# Altium schematic sheet 09_USB_HDMI.SchDoc: USB and HDMI sockets
size A3; Organization: Lime Microsystems; Address1: Surrey Tech Centre; Address2: Guildford GU2 7YG; Address3: Surrey; Address4: United Kingdom; Revision: v1.2; SheetNumber: 9; SheetTotal: 13
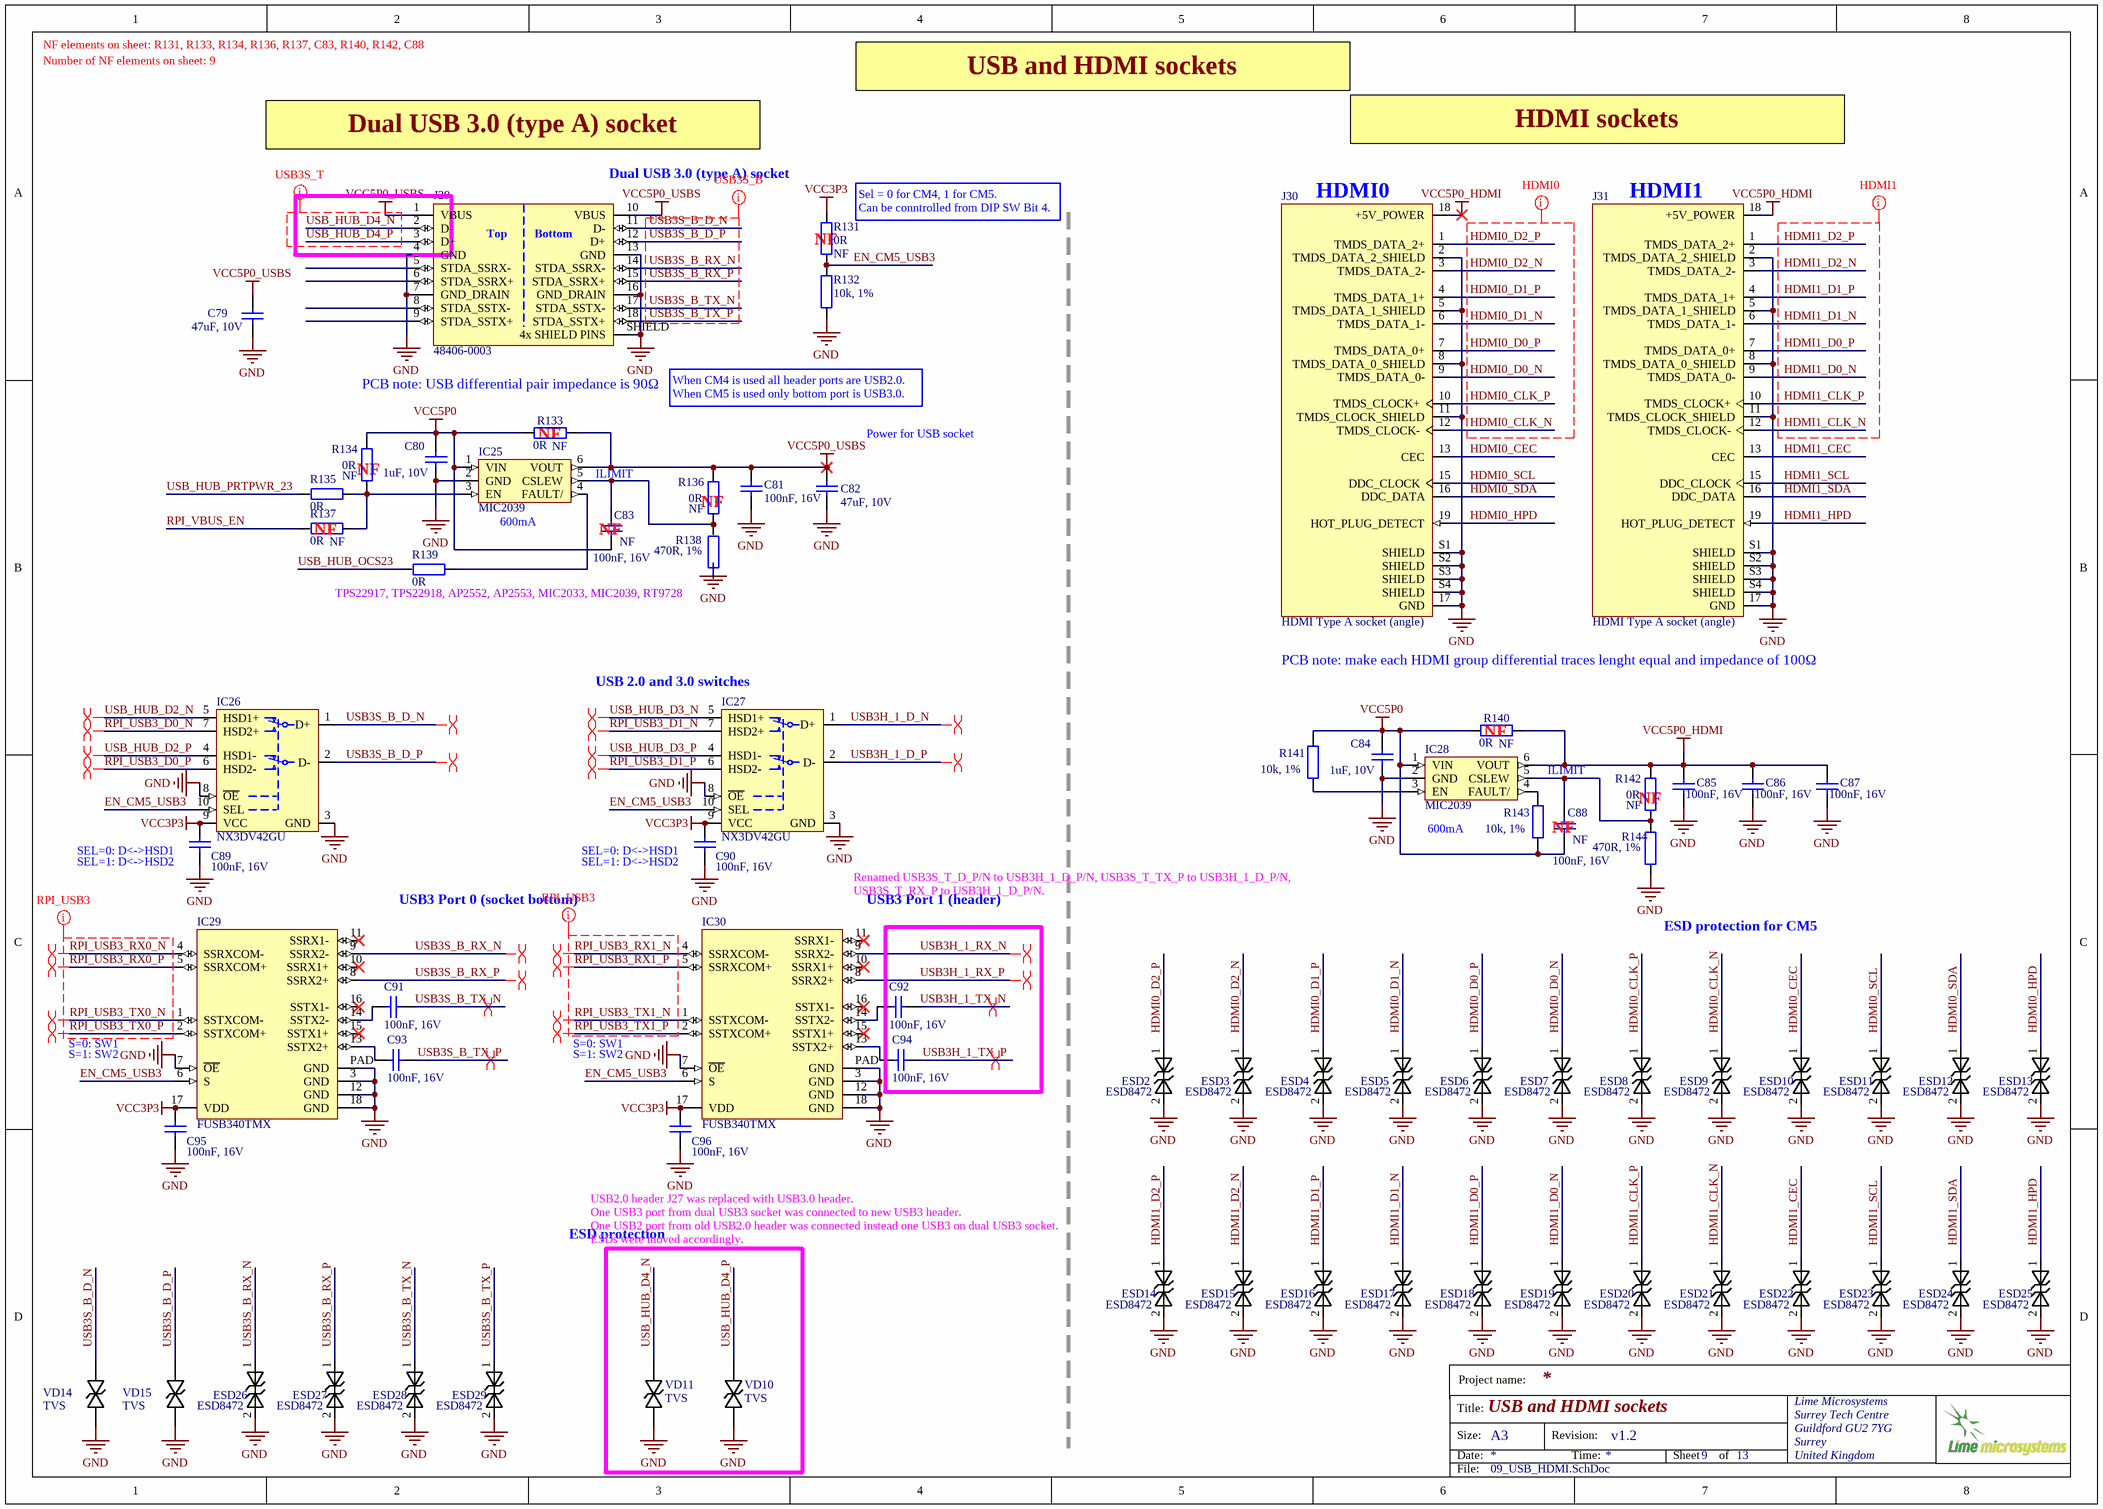
[diagram p0: 09_USB_HDMI.SchDoc]

## Parts
C79  47uF, 10V  [CAP1206]
C80  1uF, 10V  [CAP0402]
C81  100nF, 16V  [CAP0402]
C82  47uF, 10V  [CAP1206]
C83  100nF, 16V  Assembly Info: NF  [CAP0402]
C84  1uF, 10V  [CAP0402]
C85  100nF, 16V  [CAP0402]
C86  100nF, 16V  [CAP0402]
C87  100nF, 16V  [CAP0402]
C88  100nF, 16V  Assembly Info: NF  [CAP0402]
C89  100nF, 16V  [CAP0402]
C90  100nF, 16V  [CAP0402]
C91  100nF, 16V  [CAP0402]
C92  100nF, 16V  [CAP0402]
C93  100nF, 16V  [CAP0402]
C94  100nF, 16V  [CAP0402]
C95  100nF, 16V  [CAP0402]
C96  100nF, 16V  [CAP0402]
ESD2  ESD8472  [ESD8472_X3DFN2]
ESD3  ESD8472  [ESD8472_X3DFN2]
ESD4  ESD8472  [ESD8472_X3DFN2]
ESD5  ESD8472  [ESD8472_X3DFN2]
ESD6  ESD8472  [ESD8472_X3DFN2]
ESD7  ESD8472  [ESD8472_X3DFN2]
ESD8  ESD8472  [ESD8472_X3DFN2]
ESD9  ESD8472  [ESD8472_X3DFN2]
ESD10  ESD8472  [ESD8472_X3DFN2]
ESD11  ESD8472  [ESD8472_X3DFN2]
ESD12  ESD8472  [ESD8472_X3DFN2]
ESD13  ESD8472  [ESD8472_X3DFN2]
ESD14  ESD8472  [ESD8472_X3DFN2]
ESD15  ESD8472  [ESD8472_X3DFN2]
ESD16  ESD8472  [ESD8472_X3DFN2]
ESD17  ESD8472  [ESD8472_X3DFN2]
ESD18  ESD8472  [ESD8472_X3DFN2]
ESD19  ESD8472  [ESD8472_X3DFN2]
ESD20  ESD8472  [ESD8472_X3DFN2]
ESD21  ESD8472  [ESD8472_X3DFN2]
ESD22  ESD8472  [ESD8472_X3DFN2]
ESD23  ESD8472  [ESD8472_X3DFN2]
ESD24  ESD8472  [ESD8472_X3DFN2]
ESD25  ESD8472  [ESD8472_X3DFN2]
ESD26  ESD8472  [ESD8472_X3DFN2]
ESD27  ESD8472  [ESD8472_X3DFN2]
ESD28  ESD8472  [ESD8472_X3DFN2]
ESD29  ESD8472  [ESD8472_X3DFN2]
IC25  MIC2039  [SOT23-6]
IC26  NX3DV42GU  [FSUSB42UMX]
IC27  NX3DV42GU  [FSUSB42UMX]
IC28  MIC2039  [SOT23-6]
IC29  FUSB340TMX  [FUSB340TMX_USB_switch_18-XFQFN]
IC30  FUSB340TMX  [FUSB340TMX_USB_switch_18-XFQFN]
J29  48406-0003  [Dual_USB_48406-0003_Molex]
J30  HDMI Type A socket (angle)  [HDMI_HD01-19-RA-TH]
J31  HDMI Type A socket (angle)  [HDMI_HD01-19-RA-TH]
R131  0R  Assembly Info: NF  [RES0402]
R132  10k, 1%  [RES0402]
R133  0R  Assembly Info: NF  [RES0402]
R134  0R  Assembly Info: NF  [RES0402]
R135  0R  [RES0402]
R136  0R  Assembly Info: NF  [RES0402]
R137  0R  Assembly Info: NF  [RES0402]
R138  470R, 1%  [RES0402]
R139  0R  [RES0402]
R140  0R  Assembly Info: NF  [RES0402]
R141  10k, 1%  [RES0402]
R142  0R  Assembly Info: NF  [RES0402]
R143  10k, 1%  [RES0402]
R144  470R, 1%  [RES0402]
VD10  TVS  [SOD323]
VD11  TVS  [SOD323]
VD14  TVS  [SOD323]
VD15  TVS  [SOD323]

## Nets
GND: C79.1 C80.2 C81.2 C82.1 C84.2 C85.2 C86.2 C87.2 C89.2 C90.2 C95.2 C96.2 ESD2.2 ESD3.2 ESD4.2 ESD5.2 ESD6.2 ESD7.2 ESD8.2 ESD9.2 ESD10.2 ESD11.2 ESD12.2 ESD13.2 ESD14.2 ESD15.2 ESD16.2 ESD17.2 ESD18.2 ESD19.2 ESD20.2 ESD21.2 ESD22.2 ESD23.2 ESD24.2 ESD25.2 ESD26.2 ESD27.2 ESD28.2 ESD29.2 IC25.2(GND) IC26.3(GND) IC26.8(~{OE}) IC27.3(GND) IC27.8(~{OE}) IC28.2(GND) IC29.3(GND) IC29.7(~{OE}) IC29.12(GND) IC29.18(GND) IC29.PAD(GND) IC30.3(GND) IC30.7(~{OE}) IC30.12(GND) IC30.18(GND) IC30.PAD(GND) J29.4(GND) J29.7(GND_DRAIN) J29.13(GND) J29.16(GND_DRAIN) J29.SHIELD(4x_SHIELD_PINS) J30.2(TMDS_DATA_2_SHIELD) J30.5(TMDS_DATA_1_SHIELD) J30.8(TMDS_DATA_0_SHIELD) J30.11(TMDS_CLOCK_SHIELD) J30.17(GND) J30.S1(SHIELD) J30.S2(SHIELD) J30.S3(SHIELD) J30.S4(SHIELD) J31.2(TMDS_DATA_2_SHIELD) J31.5(TMDS_DATA_1_SHIELD) J31.8(TMDS_DATA_0_SHIELD) J31.11(TMDS_CLOCK_SHIELD) J31.17(GND) J31.S1(SHIELD) J31.S2(SHIELD) J31.S3(SHIELD) J31.S4(SHIELD) R132.2 R138.1 R144.1 VD10.K VD11.K VD14.K VD15.K
VCC3P3: C89.1 C90.1 C95.1 C96.1 IC26.9(VCC) IC27.9(VCC) IC29.17(VDD) IC30.17(VDD) R131.2
VCC5P0: C80.1 C83.2 C84.1 C88.2 IC25.1(VIN) IC28.1(VIN) R133.2 R134.2 R140.2 R141.2 R143.1
VCC5P0_HDMI: C85.1 C86.1 C87.1 IC28.6(VOUT) J30.18(+5V_POWER) J31.18(+5V_POWER) R140.1 R142.2
VCC5P0_USBS: C79.2 C81.1 C82.2 IC25.6(VOUT) J29.1(VBUS) J29.10(VBUS) R133.1 R136.2
EN_CM5_USB3: IC26.10(SEL) IC27.10(SEL) IC29.6(S) IC30.6(S) R131.1 R132.1
HDMI0_CEC: ESD10.1 J30.13(CEC)
HDMI0_CLK_N: ESD9.1 J30.12(TMDS_CLOCK-)
HDMI0_CLK_P: ESD8.1 J30.10(TMDS_CLOCK+)
HDMI0_D0_N: ESD7.1 J30.9(TMDS_DATA_0-)
HDMI0_D0_P: ESD6.1 J30.7(TMDS_DATA_0+)
HDMI0_D1_N: ESD5.1 J30.6(TMDS_DATA_1-)
HDMI0_D1_P: ESD4.1 J30.4(TMDS_DATA_1+)
HDMI0_D2_N: ESD3.1 J30.3(TMDS_DATA_2-)
HDMI0_D2_P: ESD2.1 J30.1(TMDS_DATA_2+)
HDMI0_HPD: ESD13.1 J30.19(HOT_PLUG_DETECT)
HDMI0_SCL: ESD11.1 J30.15(DDC_CLOCK)
HDMI0_SDA: ESD12.1 J30.16(DDC_DATA)
HDMI1_CEC: ESD22.1 J31.13(CEC)
HDMI1_CLK_N: ESD21.1 J31.12(TMDS_CLOCK-)
HDMI1_CLK_P: ESD20.1 J31.10(TMDS_CLOCK+)
HDMI1_D0_N: ESD19.1 J31.9(TMDS_DATA_0-)
HDMI1_D0_P: ESD18.1 J31.7(TMDS_DATA_0+)
HDMI1_D1_N: ESD17.1 J31.6(TMDS_DATA_1-)
HDMI1_D1_P: ESD16.1 J31.4(TMDS_DATA_1+)
HDMI1_D2_N: ESD15.1 J31.3(TMDS_DATA_2-)
HDMI1_D2_P: ESD14.1 J31.1(TMDS_DATA_2+)
HDMI1_HPD: ESD25.1 J31.19(HOT_PLUG_DETECT)
HDMI1_SCL: ESD23.1 J31.15(DDC_CLOCK)
HDMI1_SDA: ESD24.1 J31.16(DDC_DATA)
RPI_USB3_D0_N: IC26.7(HSD2+)
RPI_USB3_D0_P: IC26.6(HSD2-)
RPI_USB3_D1_N: IC27.7(HSD2+)
RPI_USB3_D1_P: IC27.6(HSD2-)
RPI_USB3_RX0_N: IC29.4(SSRXCOM-)
RPI_USB3_RX0_P: IC29.5(SSRXCOM+)
RPI_USB3_RX1_N: IC30.4(SSRXCOM-)
RPI_USB3_RX1_P: IC30.5(SSRXCOM+)
RPI_USB3_TX0_N: IC29.1(SSTXCOM-)
RPI_USB3_TX0_P: IC29.2(SSTXCOM+)
RPI_USB3_TX1_N: IC30.1(SSTXCOM-)
RPI_USB3_TX1_P: IC30.2(SSTXCOM+)
RPI_VBUS_EN: R137.2
USB3H_1_D_N: IC27.1(D+)
USB3H_1_D_P: IC27.2(D-)
USB3H_1_RX_N: IC30.9(SSRX2-)
USB3H_1_RX_P: IC30.8(SSRX2+)
USB3H_1_TX_N: C92.2
USB3H_1_TX_P: C94.2
USB3S_B_D_N: IC26.1(D+) J29.11(D-) VD14.A
USB3S_B_D_P: IC26.2(D-) J29.12(D+) VD15.A
USB3S_B_RX_N: ESD26.1 IC29.9(SSRX2-) J29.14(STDA_SSRX-)
USB3S_B_RX_P: ESD27.1 IC29.8(SSRX2+) J29.15(STDA_SSRX+)
USB3S_B_TX_N: C91.2 ESD28.1 J29.17(STDA_SSTX-)
USB3S_B_TX_P: C93.2 ESD29.1 J29.18(STDA_SSTX+)
USB_HUB_D2_N: IC26.5(HSD1+)
USB_HUB_D2_P: IC26.4(HSD1-)
USB_HUB_D3_N: IC27.5(HSD1+)
USB_HUB_D3_P: IC27.4(HSD1-)
USB_HUB_D4_N: J29.2(D-) VD11.A
USB_HUB_D4_P: J29.3(D+) VD10.A
USB_HUB_OCS23: R139.2
USB_HUB_PRTPWR_23: R135.2
NetC83_1: C83.1 IC25.5(CSLEW) R136.1 R138.2
NetC88_1: C88.1 IC28.5(CSLEW) R142.1 R144.2
NetC91_1: C91.1 IC29.14(SSTX2-)
NetC92_1: C92.1 IC30.14(SSTX2-)
NetC93_1: C93.1 IC29.13(SSTX2+)
NetC94_1: C94.1 IC30.13(SSTX2+)
NetIC25_3: IC25.3(EN) R134.1 R135.1 R137.1
NetIC25_4: IC25.4(FAULT/) R139.1
NetIC28_3: IC28.3(EN) R141.1
NetIC28_4: IC28.4(FAULT/) R143.2

Not connected (* = marked no-connect by the designer): IC29 10(SSRX1+)* 11(SSRX1-)* 15(SSTX1+)* 16(SSTX1-)*; IC30 10(SSRX1+)* 11(SSRX1-)* 15(SSTX1+)* 16(SSTX1-)*; J29 5(STDA_SSRX-) 6(STDA_SSRX+) 8(STDA_SSTX-) 9(STDA_SSTX+)

## Layout directives
differential pair: RPI_USB3_D0_N, RPI_USB3_D0_P, RPI_USB3_D1_N, RPI_USB3_D1_P, RPI_USB3_RX0_N, RPI_USB3_RX0_P, RPI_USB3_RX1_N, RPI_USB3_RX1_P, RPI_USB3_TX0_N, RPI_USB3_TX0_P, RPI_USB3_TX1_N, RPI_USB3_TX1_P, USB3H_1_D_N, USB3H_1_D_P, USB3H_1_RX_N, USB3H_1_RX_P, USB3H_1_TX_N, USB3H_1_TX_P, USB3S_B_D_N, USB3S_B_D_P, USB3S_B_RX_N, USB3S_B_RX_P, USB3S_B_TX_N, USB3S_B_TX_P, USB_HUB_D2_N, USB_HUB_D2_P, USB_HUB_D3_N, USB_HUB_D3_P
net class RPI_USB3: RPI_USB3_RX0_N, RPI_USB3_RX0_P, RPI_USB3_RX1_N, RPI_USB3_RX1_P, RPI_USB3_TX0_N, RPI_USB3_TX0_P, RPI_USB3_TX1_N, RPI_USB3_TX1_P
net class HDMI0: HDMI0_CLK_N, HDMI0_CLK_P, HDMI0_D0_N, HDMI0_D0_P, HDMI0_D1_N, HDMI0_D1_P, HDMI0_D2_N, HDMI0_D2_P
net class HDMI1: HDMI1_CLK_N, HDMI1_CLK_P, HDMI1_D0_N, HDMI1_D0_P, HDMI1_D1_N, HDMI1_D1_P, HDMI1_D2_N, HDMI1_D2_P
net class USB3S_T: USB_HUB_D4_N, USB_HUB_D4_P, VCC5P0_USBS
net class USB3S_B: USB3S_B_D_N, USB3S_B_D_P, USB3S_B_RX_N, USB3S_B_RX_P, USB3S_B_TX_N, USB3S_B_TX_P

## Notes on the sheet
- Number of NF elements on sheet: 9
- NF elements on sheet: R131, R133, R134, R136, R137, C83, R140, R142, C88
- USB and HDMI sockets
- Dual USB 3.0 (type A) socket
- (near J29) Dual USB 3.0 (type A) socket
- HDMI sockets
- (near R131) NF
- (near R131) Sel = 0 for CM4, 1 for CM5.
  Can be conntrolled from DIP SW Bit 4.
- HDMI0
- HDMI1
- PCB note: USB differential pair impedance is 90Ω
- (near R133) NF
- When CM4 is used all header ports are USB2.0.
  When CM5 is used only bottom port is USB3.0.
- Power for USB socket
- (near R134) NF
- ILIMIT
- (near R136) NF
- (near R137) NF
- (near IC25) 600mA
- (near C83) NF
- TPS22917, TPS22918, AP2552, AP2553, MIC2033, MIC2039, RT9728
- USB 2.0 and 3.0 switches
- PCB note: make each HDMI group differential traces lenght equal and impedance of 100Ω
- (near R140) NF
- (near C89) SEL=0: D<->HSD1
- (near C90) SEL=0: D<->HSD1
- (near IC28) 600mA
- NF
- (near R142) NF
- (near C89) SEL=1: D<->HSD2
- USB3 Port 0 (socket bottom)
- (near C90) SEL=1: D<->HSD2
- USB3 Port 1 (header)
- (near IC30) Renamed USB3S_T_D_P/N to USB3H_1_D_P/N, USB3S_T_TX_P to USB3H_1_D_P/N, USB3S_T_RX_P to USB3H_1_D_P/N.
- ESD protection for CM5
- S=0: SW1
- S=1: SW2
- ESD protection
- USB2.0 header J27 was replaced with USB3.0 header.
  One USB3 port from dual USB3 socket was connected to new USB3 header.
  One USB2 port from old USB2.0 header was connected instead one USB3 on dual USB3 socket.
  ESDs were moved accordingly.
- Project name:
- Title:
- Size:
- Date:
- A3
- Revision:
- Time:
- Sheet
- of
- File:
- (in symbol Dual_USB_48406-0003_Molex) Top; Bottom

## Library data of the parts
C79 C82 = Cap_1206: Manufacturer: TDK Corporation; Manufacturer Part Number 1: C3216X6S1A476M160AC; Part Description: 47µF ±20% 10V Ceramic Capacitor X6S 1206 (3216 Metric); Notification: Current market demand for these product types have resulted in fluctuating and extending lead times. Lead times may differ.; Tolerance: ±20%; Temperature Coefficient: X6S; Value: 47uF, 10V; RoHS: RoHS Compliant; Packaging: Cut Tape (CT); Operating Temperature: -55°C ~ 105°C; Voltage - Rated: 10V; Height - Seated (Max): -; Ratings: -; Applications: General Purpose; Features: Low ESL; Size / Dimension: 0.126" L x 0.063" W (3.20mm x 1.60mm); Supplier 1: Digi-Key; Lead Spacing: -; Supplier Part Number 1: 445-6010-1-ND; Thickness (Max): 0.071" (1.80mm); Failure Rate: -; Category: Capacitors; Lead Style: -; Part Status: Active; Mounting Type: Surface Mount, MLCC; Package / Case: 1206 (3216 Metric)
C80 C84 = Cap_0402: Manufacturer Part Number 1: CC0402MRX5R6BB105; Manufacturer: Yageo; Part Description: 1µF 10V Ceramic Capacitor X5R 0402 (1005 Metric) 0.039" L x 0.020" W (1.00mm x 0.50mm); Voltage Rating: 10; Capacitance Tolerance: ± 10%; Product Range: TDK - C Series; Ceramic Capacitor Case: 0402 [1005 Metric]; Capacitance: 1; Dielectric Characteristic: X6; Value: 1uF, 10V; Supplier 1: Digi-Key; Supplier Part Number 1: 311-1732-1-ND; MSL: -; RoHS: YES
C81 C83 C85-C88 = Cap_0402: Manufacturer: Murata Electronics; Manufacturer Part Number 1: GRM155R71C104KA88D; Part Description: 0.10µF ±10% 16V Ceramic Capacitor X7R 0402 (1005 Metric); Tolerance: 10 %; Type: General Purpose MLCC; Capacitance: 0.1 uF; Case Length: 1 mm; Dielectric: X7R; Case Height: 0.5 mm; Temperature Coefficient / Code: +/- 15 %; Value: 100nF, 16V; Supplier 1: Mouser; Supplier Part Number 1: 81-GRM155R71C104KA88; Case Code - in: 0402; RoHS: RoHS Compliant; Operating Temperature Range: - 55 C to + 125 C; Series: GRM; Termination Style: SMD/SMT; Package / Case: 0402 (1005 metric); Voltage Rating DC: 16 V; Maximum Operating Temperature: + 125 C; Case Code - mm: 1005; Minimum Operating Temperature: - 55 C; Product Category: Low & Medium Capacitance SMD Ceramic Chip Capacitors; Packaging: Reel; Product: General Type MLCCs; Category: Multilayer Ceramic Capacitors MLCC - SMD/SMT; Brand: Murata Electronics; Case Width: 0.5 mm; RoHS - Mouser: Y; Standard Pack Qty: 10000; Minimum Order Quantity: 1; Reeling: True; Manufacturer Part Number: GRM155R71C104KA88D
C89-C96 = Cap_0402: Manufacturer: Murata Electronics; Manufacturer Part Number: GRM155R71C104KA88D; Part Description: 0.10µF ±10% 16V Ceramic Capacitor X7R 0402 (1005 Metric); Tolerance: 10 %; Type: General Purpose MLCC; Capacitance: 0.1 uF; Case Length: 1 mm; Dielectric: X7R; Case Height: 0.5 mm; Temperature Coefficient / Code: +/- 15 %; Value: 100nF, 16V; Supplier 1: Mouser; Supplier Part Number 1: 81-GRM155R71C104KA88; Case Code - in: 0402; RoHS: RoHS Compliant; Operating Temperature Range: - 55 C to + 125 C; Series: GRM; Termination Style: SMD/SMT; Package / Case: 0402 (1005 metric); Voltage Rating DC: 16 V; Maximum Operating Temperature: + 125 C; Case Code - mm: 1005; Minimum Operating Temperature: - 55 C; Product Category: Low & Medium Capacitance SMD Ceramic Chip Capacitors; Packaging: Reel; Product: General Type MLCCs; Category: Multilayer Ceramic Capacitors MLCC - SMD/SMT; Brand: Murata Electronics; Case Width: 0.5 mm; RoHS - Mouser: Y; Standard Pack Qty: 10000; Minimum Order Quantity: 1; Reeling: True; Manufacturer Part Number 1: GRM155R71C104KA88D
ESD2-ESD29 = ESD8472: Manufacturer: ON Semiconductor; Manufacturer Part Number 1: ESD8472MUT5G; Part Description: TVS DIODE 5.3VWM 14VC X3DFN2; Voltage - Reverse Standoff (Typ): 5.3V (Max); Voltage - Breakdown (Min): 7V; Voltage - Clamping (Max) @ Ipp: 14V; Current - Peak Pulse (10/1000µs): 3A (8/20µs); Power Line Protection: No; Capacitance @ Frequency: 0.2pF @ 1MHz; Supplier 1: Digi-Key; RoHS: RoHS Compliant; Category: Circuit Protection; Stock 1: 2295; Pricing 1: 1=0.39, 10=0.315, 100=0.2142, 500=0.16068, 1000=0.12051 (USD); Packaging: Cut Tape (CT); Part Status: Active; Type: Zener; Power - Peak Pulse: -; Applications: Automotive, RF Antenna; Operating Temperature: -55°C ~ 150°C (TJ); Mounting Type: Surface Mount; Package / Case: 2-XFDFN; Supplier Device Package: 2-X3DFN (0.62x0.32); ComponentLink1URL: http://www.onsemi.com/pub/Collateral/ESD8472-D.PDF; ComponentLink1Description: http://www.onsemi.com/pub/Collateral/ESD8472-D.PDF; Supplier Part Number 1: ESD8472MUT5GOSCT-ND
IC25 IC28 = MIC2033_power_switch: Part Description: Power Switch/Driver 1:1 P-Channel 2.5A SOT-23-6; Manufacturer: Microchip; Manufacturer Part Number 1: MIC2039EYM6-TR; Number of Outputs: 1; Interface: On/Off; Max Output Current: 2.5A; Fault Protection: Over Temperature; Output Configuration: High Side; ComponentLink1URL: http://www.mouser.com/ds/2/268/mic2033-b-1076865.pdf?src-supplier=Mouser; ComponentLink1Description: http://www.mouser.com/ds/2/268/mic2033-b-1076865.pdf?src-supplier=Mouser; ComponentLink2URL: http://components.arrow.com/part/dataview/56727820S413982N1374?src-supplier=Arrow+Electronics; ComponentLink2Description: http://components.arrow.com/part/dataview/56727820S413982N1374?src-supplier=Arrow+Electronics; ComponentLink3URL: http://www.microchip.com/mymicrochip/filehandler.aspx?ddocname=en579457&src-supplier=Digi-Key; ComponentLink3Description: http://www.microchip.com/mymicrochip/filehandler.aspx?ddocname=en579457&src-supplier=Digi-Key; Supplier 1: Digi-Key; Supplier Part Number 1: 576-4193-1-ND; Stock 1: 37195; Pricing 1: 1=0,98000, 25=0,80560, 100=0,75000 (USD); RoHS: No; Case/Package: SOT-23-6; Min Operating Temperature: -40°C; Max Operating Temperature: 125°C; Package Quantity: 3000; Packaging: Tape and Reel; Series: -; ComponentLink4URL: https://datasheet.ciiva.com/6607/mic2039-6607725.pdf?src-supplier=Digi-Key; ComponentLink4Description: https://datasheet.ciiva.com/6607/mic2039-6607725.pdf?src-supplier=Digi-Key
IC26 IC27 = FSUSB42UMX: Part Description: USB Switch IC 1 Channel 10-UMLP (1.8x1.4); Manufacturer: NXP Semiconductors; Manufacturer Part Number 1: NX3DV42GU,115; ComponentLink1URL: https://www.fairchildsemi.com/datasheets/FS/FSUSB42.pdf; ComponentLink1Description: https://www.fairchildsemi.com/datasheets/FS/FSUSB42.pdf; Supplier 1: Digikey; Supplier Part Number 1: 568-12388-1-ND; Stock 1: 3109; Pricing 1: 1=0,89, 10=0,781, 25=0,7336, 100=0,5987, 250=0,55612, 500=0,47328, 1000=0,37863 (USD); RoHS: Yes; ComponentLink2URL: http://www.mouser.com/ds/2/302/NX3DV42-1127466.pdf?src-supplier=Mouser; ComponentLink2Description: http://www.mouser.com/ds/2/302/NX3DV42-1127466.pdf?src-supplier=Mouser; ComponentLink3URL: http://www.nxp.com/documents/data_sheet/NX3DV42.pdf?src-supplier=Avnet; ComponentLink3Description: http://www.nxp.com/documents/data_sheet/NX3DV42.pdf?src-supplier=Avnet; ComponentLink4URL: http://www.nxp.com/documents/data_sheet/NX3DV42.pdf?src-supplier=Digikey; ComponentLink4Description: http://www.nxp.com/documents/data_sheet/NX3DV42.pdf?src-supplier=Digikey; ComponentLink5URL: https://www.nxp.com/docs/en/data-sheet/NX3DV42.pdf?src-supplier=Digikey; ComponentLink5Description: https://www.nxp.com/docs/en/data-sheet/NX3DV42.pdf?src-supplier=Digikey
IC29 IC30 = FUSB340TMX_USB_switch: Part Description: USB Switch USB 3.1 USB Interface 18-TMLP (2x2.8); Manufacturer: ON Semiconductor / Fairchild; Interface: USB; Operating Supply Current: 12uA; Number of Switches: 4; Data Rate: 10Gbps; Max Supply Voltage: 5V; Min Supply Voltage: 1.5V; Supplier 1: Digikey; Supplier Part Number 1: FUSB340TMXCT-ND; Manufacturer Part Number 1: FUSB340TMX; Stock 1: 7942; Pricing 1: 1=1,15, 10=1,026, 25=0,9744, 100=0,7481, 250=0,66108, 500=0,6263, 1000=0,48712, 2500=0,46277 (USD); RoHS: Yes; Mount: Surface Mount; Number of Pins: 18; Weight: 0.0065g; Min Operating Temperature: -40°C; Max Operating Temperature: 85°C; Packaging: Cut Tape; Series: -; Nominal Supply Current: 12uA; Height: 400um; RoHS Compliant: Yes; ComponentLink1URL: http://www.farnell.com/datasheets/2313412.pdf?src-supplier=Farnell; ComponentLink1Description: http://www.farnell.com/datasheets/2313412.pdf?src-supplier=Farnell; ComponentLink2URL: http://www.farnell.com/datasheets/2313412.pdf?src-supplier=Newark; ComponentLink2Description: http://www.farnell.com/datasheets/2313412.pdf?src-supplier=Newark; ComponentLink3URL: https://datasheet.octopart.com/FUSB340TMX-ON-Semiconductor-datasheet-85553255.pdf?src-supplier=Farnell; ComponentLink3Description: https://datasheet.octopart.com/FUSB340TMX-ON-Semiconductor-datasheet-85553255.pdf?src-supplier=Farnell; ComponentLink4URL: https://datasheet.octopart.com/FUSB340TMX-ON-Semiconductor-datasheet-46935021.pdf?src-supplier=Future+Electronics; ComponentLink4Description: https://datasheet.octopart.com/FUSB340TMX-ON-Semiconductor-datasheet-46935021.pdf?src-supplier=Future+Electronics; ComponentLink5URL: https://www.fairchildsemi.com/Assets/-Featured-Collateral/Datasheet-Briefs/FUSB340_PB_Final.pdf?src-supplier=Avnet; ComponentLink5Description: https://www.fairchildsemi.com/Assets/-Featured-Collateral/Datasheet-Briefs/FUSB340_PB_Final.pdf?src-supplier=Avnet
J29 = Dual_USB_48406-0003_Molex: Part Description: USB Connectors USB 3.0 F/A STD RA REC STACKED 15u'; Manufacturer: Molex; Manufacturer Part Number 1: 0484060003; Supplier 1: Mouser; Supplier Part Number 1: 538-48406-0003; Stock 1: 4086; Pricing 1: 1=2,69, 10=1,92, 50=1,92, 100=1,82, 1000=1,78, 10000=1,43 (USD); RoHS: Yes; ComponentLink1URL: https://datasheet.octopart.com/48406-0003-Molex-datasheet-33003502.pdf?src-supplier=Newark; ComponentLink1Description: https://datasheet.octopart.com/48406-0003-Molex-datasheet-33003502.pdf?src-supplier=Newark; ComponentLink2URL: https://datasheet.octopart.com/48406-0003-Molex-datasheet-101583044.pdf?src-supplier=Farnell; ComponentLink2Description: https://datasheet.octopart.com/48406-0003-Molex-datasheet-101583044.pdf?src-supplier=Farnell; ComponentLink3URL: https://www.molex.com/pdm_docs/sd/484060003_sd.pdf?src-supplier=Digikey; ComponentLink3Description: https://www.molex.com/pdm_docs/sd/484060003_sd.pdf?src-supplier=Digikey; ComponentLink4URL: https://datasheet.octopart.com/484060003-Molex-datasheet-168216735.pdf?src-supplier=TME; ComponentLink4Description: https://datasheet.octopart.com/484060003-Molex-datasheet-168216735.pdf?src-supplier=TME; ComponentLink5URL: https://datasheet.octopart.com/48406-0003-Molex-datasheet-21137617.pdf?src-supplier=Sager+Electronics; ComponentLink5Description: https://datasheet.octopart.com/48406-0003-Molex-datasheet-21137617.pdf?src-supplier=Sager+Electronics; ComponentLink6URL: https://datasheet.octopart.com/48406-0003-Molex-datasheet-154752298.pdf?src-supplier=Master+Electronics; ComponentLink6Description: https://datasheet.octopart.com/48406-0003-Molex-datasheet-154752298.pdf?src-supplier=Master+Electronics
J30 J31 = HDMI_HD01-19-RA-TH: Manufacturer: CUI Devices; Part Description: HDMI HDMI 2.1 Receptacle Connector 19 Position Through Hole, Right Angle; Supplier 1: Digi-Key; Supplier Part Number 1: 2223-HD01-19-RA-TH-ND; Manufacturer Part Number 1: HD01-19-RA-TH; Stock 1: 2182; Pricing 1: 1=2,15000, 10=1,87000, 25=1,79080, 70=1,75100, 140=1,67136, 280=1,51221, 490=1,39282, 980=1,19385, 2450=1,11426 (USD); RoHS: No
R131 R133-R137 R139 R140 R142 = Res_0402: Manufacturer Part Number 1: RC0402JR-070RL; Manufacturer: Yageo; Part Description: RES SMD 0.0OHM JUMPER 1/16W 0402; Resistance (Ohms): 0.0; Tolerance: Jumper; Power (Watts): 0.063W, 1/16W; Value: 0R; Supplier 1: Digi-Key; Supplier Part Number 1: 311-0.0JRTR-ND; Category: Resistors; Temperature Coefficient: -; Features: Moisture Resistant; Supplier Device Package: 0402; Height: 0.016" (0.40mm); Package / Case: 0402 (1005 Metric); Operating Temperature: -55°C ~ 155°C; Size / Dimension: 0.039" L x 0.020" W (1.00mm x 0.50mm); Composition: Thick Film; Packaging: Tape & Reel (TR); Number of Terminations: 2; RoHS: RoHS Compliant
R132 R141 R143 = Res_0402: Manufacturer: Yageo; Manufacturer Part Number 1: RC0402FR-0710KL; Part Description: RES SMD 10K OHM 1% 1/16W 0402; Temperature Coefficient: ±100ppm/°C; Power (Watts): 0.063W, 1/16W; Value: 10k, 1%; Supplier 1: Digi-Key; Supplier Part Number 1: 311-10.0KLRTR-ND; Resistance (Ohms): 10k; Packaging: Tape & Reel (TR); RoHS: RoHS Compliant; Package / Case: 0402 (1005 Metric); Tolerance: ±1%; Operating Temperature: -55°C ~ 155°C; Size / Dimension: 0.039" L x 0.020" W (1.00mm x 0.50mm); Number of Terminations: 2; Category: Resistors; Height: 0.016" (0.40mm); Supplier Device Package: 0402; Features: Moisture Resistant; Composition: Thick Film
R138 R144 = Res_0402: Manufacturer 1: Yageo; Manufacturer Part Number 1: RC0402FR-07470RL; Part Description: 470 Ohms ±1% 0.063W, 1/16W Chip Resistor 0402 (1005 Metric) Moisture Resistant Thick Film; Power Rating: 62.5mW; Temperature Coefficient: 100ppm/°C; Voltage Rating: 50V; Max Power Dissipation: 63mW; Value: 470R, 1%; Supplier 1: Digi-Key; Supplier Part Number 1: 311-470LRCT-ND; Stock 1: 1652476; Pricing 1: 1=0,10000, 10=0,01600, 100=0,00660, 1000=0,00299, 2500=0,00259, 5000=0,00214 (USD); RoHS: Yes; Case/Package: 0402; Case Code (Metric): 1005; Case Code (Imperial): 0402; Size Code: 0402; Min Operating Temperature: -55°C; Max Operating Temperature: 155°C; Packaging: Tape and Reel; Tolerance: 1%; Resistance: 470R; Number of Terminations: 2; Features: Moisture Resistant; Package Quantity: 1; Resistor Type: Thick Film; Termination: SMD/SMT; Series: RC; Resistance Tolerance: 1%; Construction: Rectangular; Length: 1mm; Width: 0.02inch; Height: 0.016inch; Depth: 0.5mm; Lead Free: Lead Free; REACH SVHC: Unknown; Military Standard: Not; RoHS Compliant: Yes; Manufacturer: Yageo
VD10 VD11 VD14 VD15 = DIODE_TVS: Manufacturer 1: Sangdest Microelectronics; Manufacturer Part Number: SD03LCC; Part Description: 19V Clamp 20A (8/20µs) Ipp Tvs Diode Surface Mount SOD-323; ComponentLink1URL: https://datasheet.ciiva.com/29588/littelfuse-tvs-diode-array-sp4020-datasheet-pdf-29588193.pdf?src-supplier=Digi-Key; ComponentLink1Description: https://datasheet.ciiva.com/29588/littelfuse-tvs-diode-array-sp4020-datasheet-pdf-29588193.pdf?src-supplier=Digi-Key; ComponentLink2URL: https://datasheet.ciiva.com/24111/littelfuse-sp4020-267385-24111169.pdf?src-supplier=Mouser; ComponentLink2Description: https://datasheet.ciiva.com/24111/littelfuse-sp4020-267385-24111169.pdf?src-supplier=Mouser; Supplier 1: Digi-Key; Supplier Part Number 1: 1655-SD03LCCCT-ND; Stock 1: 8808; Pricing 1: 1=0,37000, 10=0,27300, 100=0,15460, 500=0,10240, 1000=0,07851 (USD); RoHS: No; Manufacturer: Sangdest Microelectronics; Manufacturer Part Number 1: SD03LCC